# Altium project RTL8211.PrjPCB
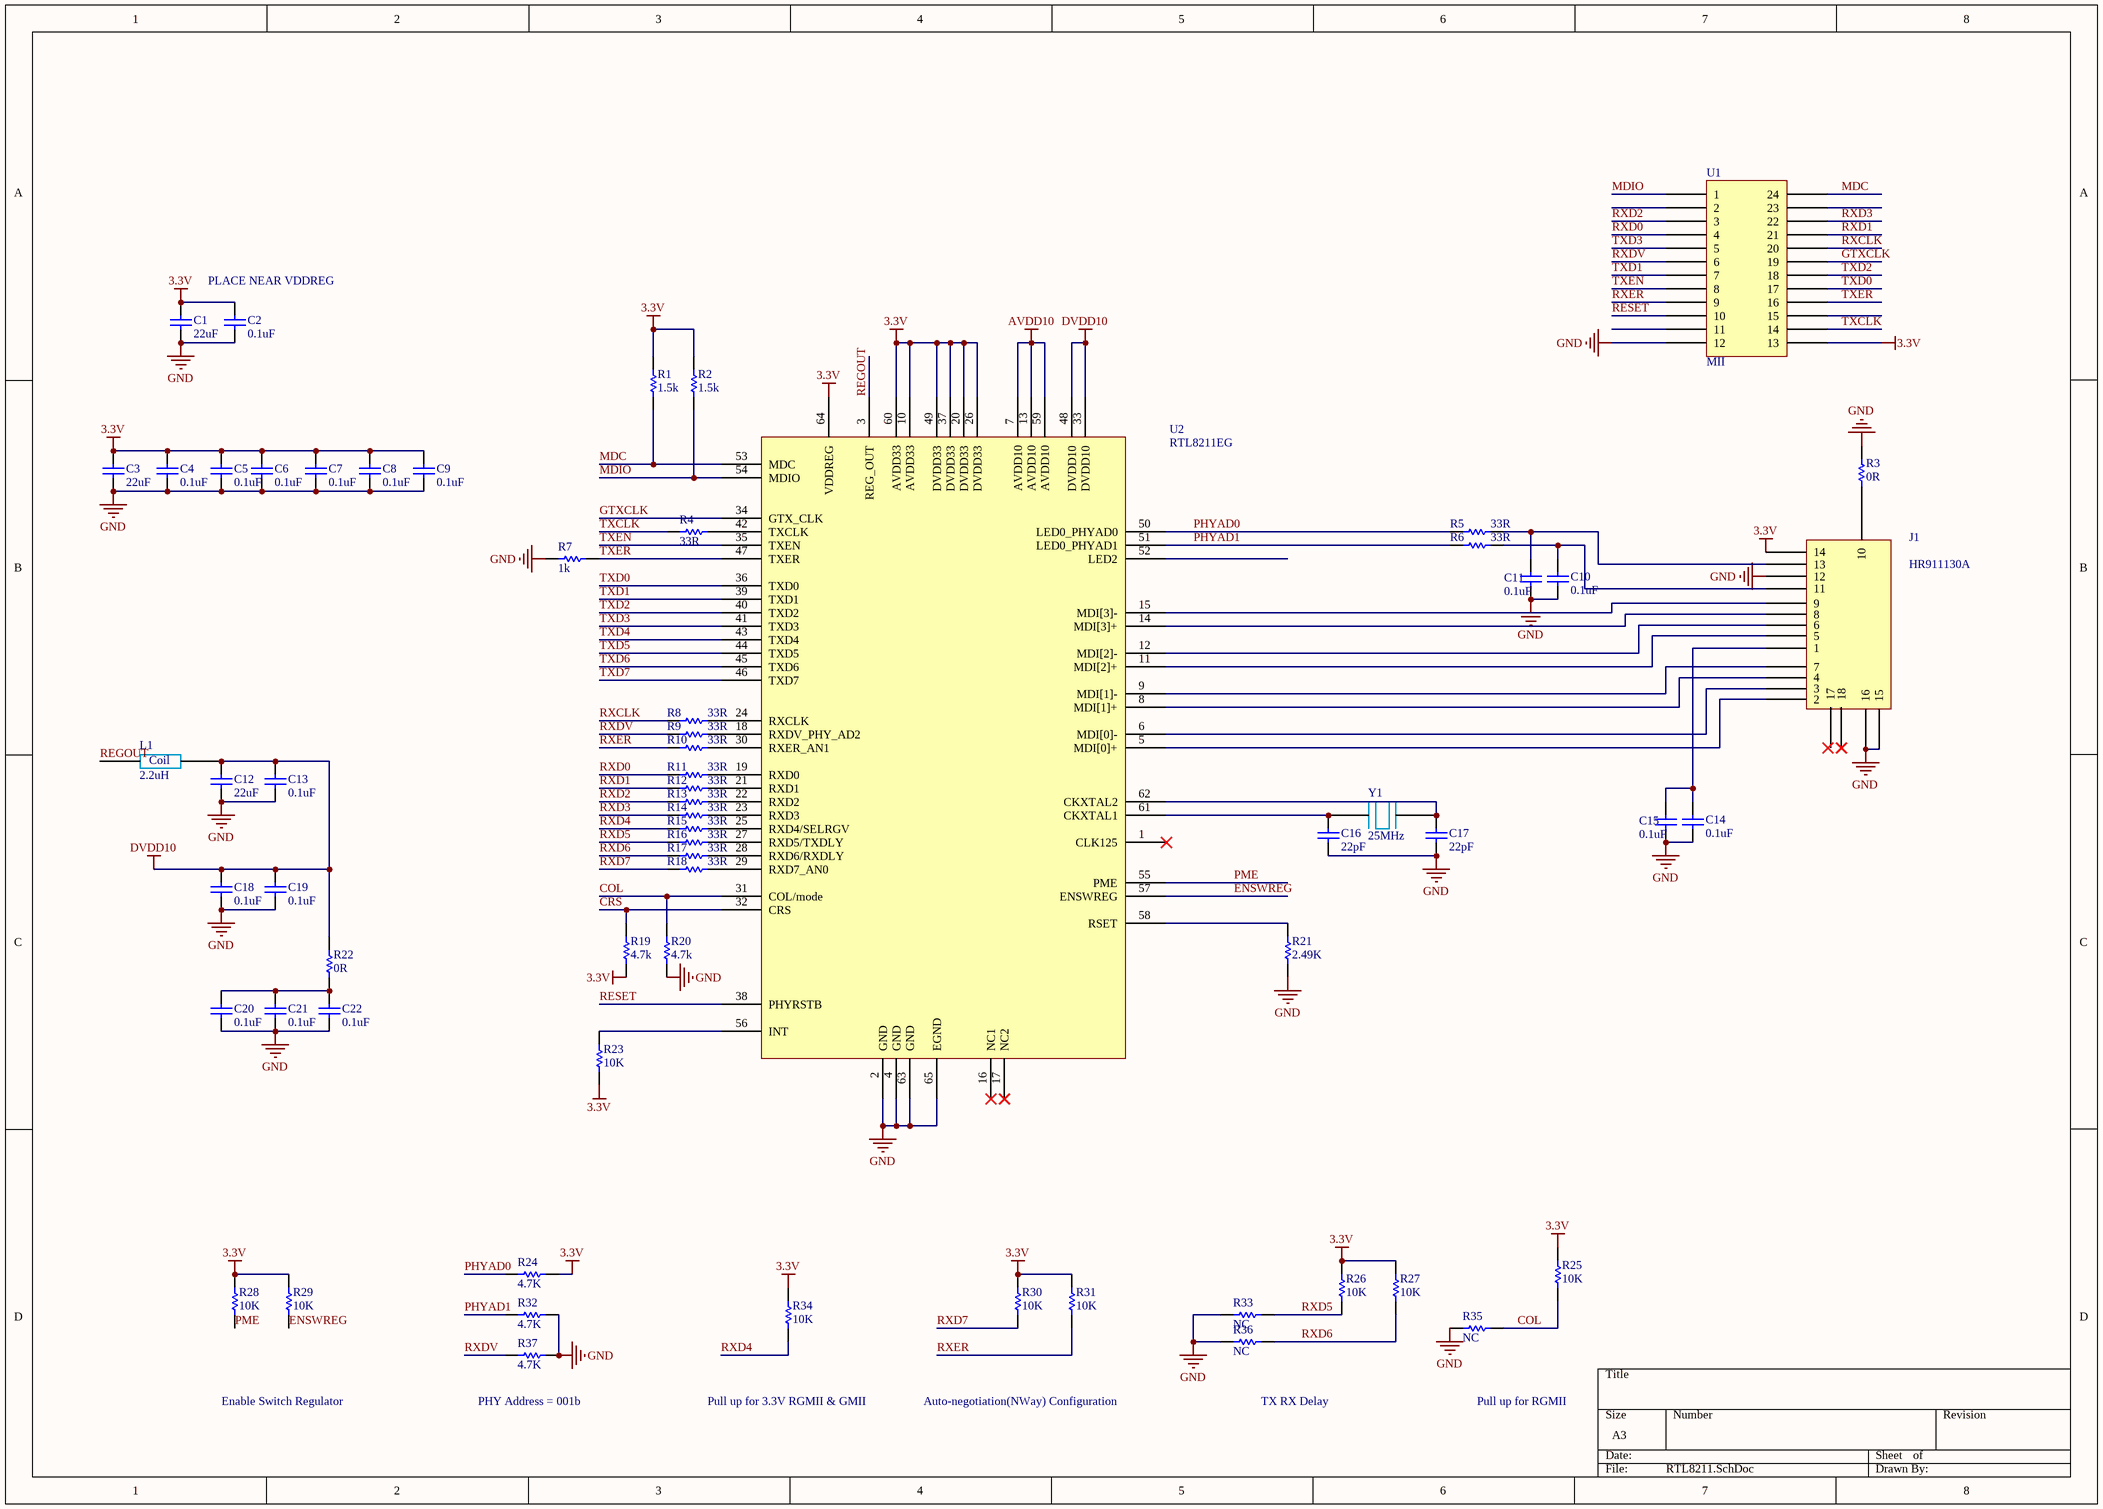
[diagram p0: RTL8211.SchDoc]
1 sheet, 64 parts. Net scope: global (net labels, ports and power ports of the same name join across sheets).
Board file: RTL8211.PcbDoc

## Sheet RTL8211.SchDoc
size A3

### Parts
C1  22uF  [0805C]
C2  0.1uF  [0805C]
C3  22uF  [0805C]
C4  0.1uF  [0805C]
C5  0.1uF  [0805C]
C6  0.1uF  [0805C]
C7  0.1uF  [0805C]
C8  0.1uF  [0805C]
C9  0.1uF  [0805C]
C10  0.1uF  [0805C]
C11  0.1uF  [0805C]
C12  22uF  [0805C]
C13  0.1uF  [0805C]
C14  0.1uF  [0805C]
C15  0.1uF  [0805C]
C16  22pF  [0805C]
C17  22pF  [0805C]
C18  0.1uF  [0805C]
C19  0.1uF  [0805C]
C20  0.1uF  [0805C]
C21  0.1uF  [0805C]
C22  0.1uF  [0805C]
J1  HR911130A  [HR911130A]
L1  2.2uH  [Coil]
R1  value 1.5k  [0805]  (hidden comment: Res)
R2  value 1.5k  [0805]  (hidden comment: Res)
R3  value 0R  [0805]  (hidden comment: Res)
R4  value 33R  [0805]  (hidden comment: Res)
R5  value 33R  [0805]  (hidden comment: Res)
R6  value 33R  [0805]  (hidden comment: Res)
R7  value 1k  [0805]  (hidden comment: Res)
R8  value 33R  [0805]  (hidden comment: Res)
R9  value 33R  [0805]  (hidden comment: Res)
R10  value 33R  [0805]  (hidden comment: Res)
R11  value 33R  [0805]  (hidden comment: Res)
R12  value 33R  [0805]  (hidden comment: Res)
R13  value 33R  [0805]  (hidden comment: Res)
R14  value 33R  [0805]  (hidden comment: Res)
R15  value 33R  [0805]  (hidden comment: Res)
R16  value 33R  [0805]  (hidden comment: Res)
R17  value 33R  [0805]  (hidden comment: Res)
R18  value 33R  [0805]  (hidden comment: Res)
R19  value 4.7k  [0805]  (hidden comment: Res)
R20  value 4.7k  [0805]  (hidden comment: Res)
R21  value 2.49K  [0805]  (hidden comment: Res)
R22  value 0R  [0805]  (hidden comment: Res)
R23  value 10K  [0805]  (hidden comment: Res)
R24  value 4.7K  [0805]  (hidden comment: Res)
R25  value 10K  [0805]  (hidden comment: Res)
R26  value 10K  [0805]  (hidden comment: Res)
R27  value 10K  [0805]  (hidden comment: Res)
R28  value 10K  [0805]  (hidden comment: Res)
R29  value 10K  [0805]  (hidden comment: Res)
R30  value 10K  [0805]  (hidden comment: Res)
R31  value 10K  [0805]  (hidden comment: Res)
R32  value 4.7K  [0805]  (hidden comment: Res)
R33  value NC  [0805]  (hidden comment: Res)
R34  value 10K  [0805]  (hidden comment: Res)
R35  value NC  [0805]  (hidden comment: Res)
R36  value NC  [0805]  (hidden comment: Res)
R37  value 4.7K  [0805]  (hidden comment: Res)
U1  MII  [MII]
U2  RTL8211EG  [RTL8211EGQFN]
Y1  25MHz  [XTAL]

### Nets
3.3V: C1.2 C2.2 C3.2 C4.2 C5.2 C6.2 C7.2 C8.2 C9.2 J1.14 R1.2 R2.2 R19.2 R23.2 R24.2 R25.1 R26.1 R27.1 R28.1 R29.1 R30.1 R31.1 R34.1 U1.13 U2.10(AVDD33) U2.20(DVDD33) U2.26(DVDD33) U2.37(DVDD33) U2.49(DVDD33) U2.60(AVDD33) U2.64(VDDREG)
AVDD10: U2.7(AVDD10) U2.13(AVDD10) U2.59(AVDD10)
DVDD10: C12.2 C13.2 C18.2 C19.2 L1.2 R22.1 U2.33(DVDD10) U2.48(DVDD10)
GND: C1.1 C2.1 C3.1 C4.1 C5.1 C6.1 C7.1 C8.1 C9.1 C10.1 C11.1 C12.1 C13.1 C14.1 C15.1 C16.1 C17.1 C18.1 C19.1 C20.1 C21.1 C22.1 J1.12 J1.15 J1.16 R3.1 R7.2 R20.2 R21.2 R32.2 R33.1 R35.1 R36.1 R37.2 U1.12 U2.2(GND) U2.4(GND) U2.63(GND) U2.65(EGND)
COL: R20.1 R25.2 R35.2 U2.31(COL/mode)
CRS: R19.1 U2.32(CRS)
ENSWREG: R29.2 U2.57(ENSWREG)
GTXCLK: U1.19 U2.34(GTX_CLK)
MDC: R1.1 U1.24 U2.53(MDC)
MDIO: R2.1 U1.1 U2.54(MDIO)
PHYAD0: R5.2 R24.1 U2.50(LED0_PHYAD0)
PHYAD1: R6.2 R32.1 U2.51(LED0_PHYAD1)
PME: R28.2 U2.55(PME)
REGOUT: L1.1 U2.3(REG_OUT)
RESET: U1.10 U2.38(PHYRSTB)
RXCLK: R8.2 U1.20
RXD0: R11.2 U1.4
RXD1: R12.2 U1.21
RXD2: R13.2 U1.3
RXD3: R14.2 U1.22
RXD4: R15.2 R34.2
RXD5: R16.2 R26.2 R33.2
RXD6: R17.2 R27.2 R36.2
RXD7: R18.2 R30.2
RXDV: R9.2 R37.1 U1.6
RXER: R10.2 R31.2 U1.9
TXCLK: R4.2 U1.14
TXD0: U1.17 U2.36(TXD0)
TXD1: U1.7 U2.39(TXD1)
TXD2: U1.18 U2.40(TXD2)
TXD3: U1.5 U2.41(TXD3)
TXD4: U2.43(TXD4)
TXD5: U2.44(TXD5)
TXD6: U2.45(TXD6)
TXD7: U2.46(TXD7)
TXEN: U1.8 U2.35(TXEN)
TXER: R7.1 U1.16 U2.47(TXER)
NetC10_2: C10.2 J1.11 R6.1
NetC11_2: C11.2 J1.13 R5.1
NetC14_2: C14.2 C15.2 J1.1
NetC16_2: C16.2 U2.61(CKXTAL1) Y1.1
NetC17_2: C17.2 U2.62(CKXTAL2) Y1.2
NetC20_2: C20.2 C21.2 C22.2 R22.2
NetJ1_2: J1.2 U2.5(MDI[0]+)
NetJ1_3: J1.3 U2.6(MDI[0]-)
NetJ1_4: J1.4 U2.8(MDI[1]+)
NetJ1_5: J1.5 U2.11(MDI[2]+)
NetJ1_6: J1.6 U2.12(MDI[2]-)
NetJ1_7: J1.7 U2.9(MDI[1]-)
NetJ1_8: J1.8 U2.14(MDI[3]+)
NetJ1_9: J1.9 U2.15(MDI[3]-)
NetJ1_10: J1.10 R3.2
NetR4_1: R4.1 U2.42(TXCLK)
NetR8_1: R8.1 U2.24(RXCLK)
NetR9_1: R9.1 U2.18(RXDV_PHY_AD2)
NetR10_1: R10.1 U2.30(RXER_AN1)
NetR11_1: R11.1 U2.19(RXD0)
NetR12_1: R12.1 U2.21(RXD1)
NetR13_1: R13.1 U2.22(RXD2)
NetR14_1: R14.1 U2.23(RXD3)
NetR15_1: R15.1 U2.25(RXD4/SELRGV)
NetR16_1: R16.1 U2.27(RXD5/TXDLY)
NetR17_1: R17.1 U2.28(RXD6/RXDLY)
NetR18_1: R18.1 U2.29(RXD7_AN0)
NetR21_1: R21.1 U2.58(RSET)
NetR23_1: R23.1 U2.56(INT)

Not connected (* = marked no-connect by the designer): J1 17 18*; U1 2 11 15 23; U2 1(CLK125)* 16(NC1)* 17(NC2)* 52(LED2)

### Notes on the sheet
- PLACE NEAR VDDREG
- Enable Switch Regulator
- (near R37) PHY Address = 001b
- Pull up for 3.3V RGMII & GMII
- Auto-negotiation(NWay) Configuration
- TX RX Delay
- Pull up for RGMII

### Library data of the parts
C1-C22 = Cap: Capacitor; Published: 8-Jun-2000; LatestRevisionDate: 17-Jul-2002; LatestRevisionNote: Re-released for DXP Platform.; Publisher: Altium Limited
  C1 C3 C12: Value: 22uF
  C2 C4-C11 C13-C15 C18-C22: Value: 0.1uF
  C16 C17: Value: 22pF
L1 = Coil
R1-R37 = Res: Resistor; Published: 8-Jun-2000; LatestRevisionDate: 17-Jul-2002; LatestRevisionNote: Re-released for DXP Platform.; PackageReference: AXIAL-0.3; Publisher: Altium Limited
Y1 = XTAL